# EAGLE design audio sense board rv1 (EAGLE 9.3.0)
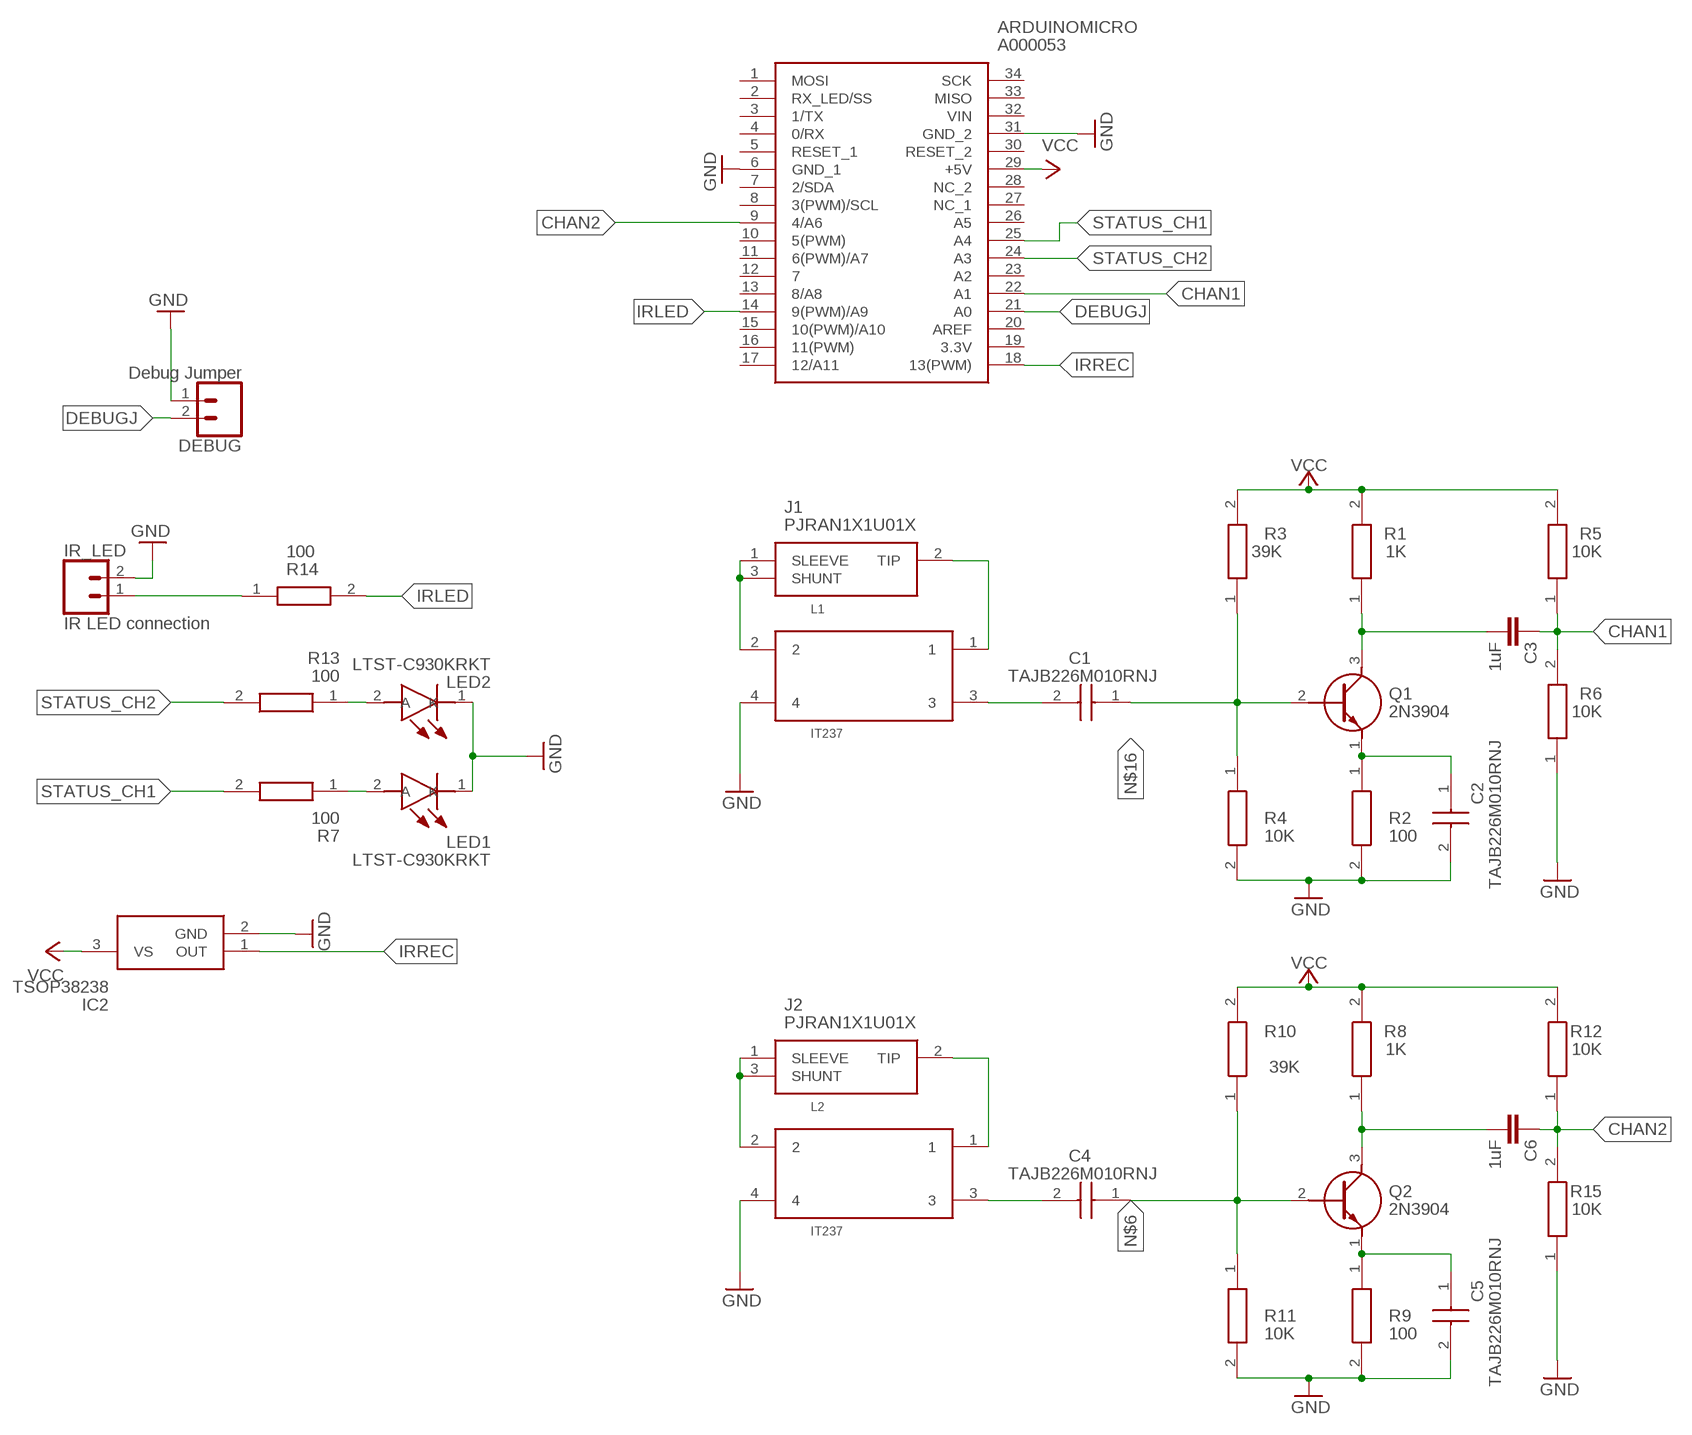
[diagram p0: schematic, sheet 1]

## Parts
ARDUINOMICRO  A000053  [HDRV34W70P1570X254_2X17_4900X1]
C1  TAJB226M010RNJ  [CAPPM3528X210N]
C2  TAJB226M010RNJ  [CAPPM3528X210N]
C3  1uF  22PF-PTH-2.54MM-200V-5%  [CAP-PTH-2.54]
C4  TAJB226M010RNJ  [CAPPM3528X210N]
C5  TAJB226M010RNJ  [CAPPM3528X210N]
C6  1uF  22PF-PTH-2.54MM-200V-5%  [CAP-PTH-2.54]
DEBUG  Debug Jumper  CONN_02LOCK  [1X02_LOCK]
IC2  TSOP38238  [TSOP38238]
IR_LED  IR LED connection  CONN_02LOCK  [1X02_LOCK]
J1  PJRAN1X1U01X  [PJRAN1X1U01X]
J2  PJRAN1X1U01X  [PJRAN1X1U01X]
L1  IT237  [IT237]
L2  IT237  [IT237]
LED1  LTST-C930KRKT  [LTSTC930KRKT]
LED2  LTST-C930KRKT  [LTSTC930KRKT]
Q1  2N3904  [CS_TO-92]
Q2  2N3904  [CS_TO-92]
R1  1K  ERJ-8GEYJ102V  [RESC3116X70N]
R2  100  ERJ8GEYJ101V  [RESC3116X70N]
R3  39K  ERJ8GEYJ101V  [RESC3116X70N]
R4  10K  ERJ8GEYJ101V  [RESC3116X70N]
R5  10K  ERJ8GEYJ101V  [RESC3116X70N]
R6  10K  ERJ8GEYJ101V  [RESC3116X70N]
R7  100  ERJ8GEYJ101V  [RESC3116X70N]
R8  1K  ERJ-8GEYJ102V  [RESC3116X70N]
R9  100  ERJ8GEYJ101V  [RESC3116X70N]
R10  39K  ERJ8GEYJ101V  [RESC3116X70N]
R11  10K  ERJ8GEYJ101V  [RESC3116X70N]
R12  10K  ERJ8GEYJ101V  [RESC3116X70N]
R13  100  ERJ8GEYJ101V  [RESC3116X70N]
R14  100  ERJ8GEYJ101V  [RESC3116X70N]
R15  10K  ERJ8GEYJ101V  [RESC3116X70N]

## Nets
CHAN1: ARDUINOMICRO.22(A1) C3.1 R5.1 R6.2
CHAN2: ARDUINOMICRO.9(4/A6) C6.1 R12.1 R15.2
DEBUGJ: ARDUINOMICRO.21(A0) DEBUG.2
GND: ARDUINOMICRO.6(GND_1) ARDUINOMICRO.31(GND_2) C2.2(-) C5.2(-) DEBUG.1 IC2.2(GND) IR_LED.2 L1.4 L2.4 LED1.1(K) LED2.1(K) R2.2 R4.2 R6.1 R9.2 R11.2 R15.1
IRLED: ARDUINOMICRO.14(9(PWM)/A9) R14.2
IRREC: ARDUINOMICRO.18(13(PWM)) IC2.1(OUT)
N$1: J2.1(SLEEVE) J2.3(SHUNT) L2.2
N$2: LED2.2(A) R13.1
N$3: J2.2(TIP) L2.1
N$4: LED1.2(A) R7.1
N$5: C4.2(-) L2.3
N$6: C4.1(+) Q2.2(B) R10.1 R11.1
N$7: C5.1(+) Q2.1(E) R9.1
N$8: C6.2 Q2.3(C) R8.1
N$9: IR_LED.1 R14.1
N$12: J1.1(SLEEVE) J1.3(SHUNT) L1.2
N$15: J1.2(TIP) L1.1
N$16: C1.1(+) Q1.2(B) R3.1 R4.1
N$17: C1.2(-) L1.3
N$20: C2.1(+) Q1.1(E) R2.1
N$21: C3.2 Q1.3(C) R1.1
STATUS_CH1: ARDUINOMICRO.25(A4) R7.2
STATUS_CH2: ARDUINOMICRO.24(A3) R13.2
VCC: ARDUINOMICRO.29(+5V) IC2.3(VS) R1.2 R3.2 R5.2 R8.2 R10.2 R12.2
Unconnected: ARDUINOMICRO.1(MOSI) ARDUINOMICRO.2(RX_LED/SS) ARDUINOMICRO.3(1/TX) ARDUINOMICRO.4(0/RX) ARDUINOMICRO.5(RESET_1) ARDUINOMICRO.7(2/SDA) ARDUINOMICRO.8(3(PWM)/SCL) ARDUINOMICRO.10(5(PWM)) ARDUINOMICRO.11(6(PWM)/A7) ARDUINOMICRO.12 ARDUINOMICRO.13(8/A8) ARDUINOMICRO.15(10(PWM)/A10) ARDUINOMICRO.16(11(PWM)) ARDUINOMICRO.17(12/A11) ARDUINOMICRO.19(3.3V) ARDUINOMICRO.20(AREF) ARDUINOMICRO.23(A2) ARDUINOMICRO.26(A5) ARDUINOMICRO.27(NC_1) ARDUINOMICRO.28(NC_2) ARDUINOMICRO.30(RESET_2) ARDUINOMICRO.32(VIN) ARDUINOMICRO.33(MISO) ARDUINOMICRO.34(SCK)

## Library data of the parts
ARDUINOMICRO = Samac Populated:A000053: Arduino Micro Arduino Micro Source: Datasheet <http://uk.rs-online.com/web/p/products/7717667>; DESCRIPTION: Arduino Micro Arduino Micro; HEIGHT: 16mm; MANUFACTURER_NAME: Arduino; MANUFACTURER_PART_NUMBER: A000053; MOUSER_PART_NUMBER: 782-A000053; MOUSER_PRICE-STOCK: https://www.mouser.com/Search/Refine.aspx?Keyword=782-A000053; RS_PART_NUMBER: 7717667; RS_PRICE-STOCK: http://uk.rs-online.com/web/p/products/7717667
C1 C2 C4 C5 = Samac Populated:TAJB226M010RNJ: Tantalum Capacitors - Solid SMD 10volts 22uF 20% Source: Datasheet <http://www.farnell.com/datasheets/1680476.pdf>; DESCRIPTION: Tantalum Capacitors - Solid SMD 10volts 22uF 20%; HEIGHT: 2.1mm; MANUFACTURER_NAME: AVX; MANUFACTURER_PART_NUMBER: TAJB226M010RNJ; MOUSER_PART_NUMBER: 581-TAJB226M010R; MOUSER_PRICE-STOCK: https://www.mouser.com/Search/Refine.aspx?Keyword=581-TAJB226M010R; RS_PART_NUMBER: 1354085; RS_PRICE-STOCK: http://uk.rs-online.com/web/p/products/1354085
C3 C6 = SparkFun-Capacitors:22PF: 22pF ceramic capacitors A capacitor is a passive two-terminal electrical component used to store electrical energy temporarily in an electric field.; PROD_ID: CAP-09128; VALUE: 22pF
DEBUG IR_LED = SparkFun-Connectors:CONN_02: Multi connection point. Often used as Generic Header-pin footprint for 0.1 inch spaced/style header connections On any of the 0.1 inch spaced packages, you can populate with these: Break Away Headers - Straight <https://www.sparkfun.com/products/116> (PRT-00116) Break Away Male Headers - Right Angle <https://www.sparkfun.com/products/553> (PRT-00553) Female Headers <https://www.sparkfun.com/products/115> (PRT-00115) Break Away Headers - Machine Pin <https://www.sparkfun.com/products/117> (PRT-00117) Break Away Female Headers - Swiss Machine Pin <https://www.sparkfun.com/products/743> (PRT-00743) For SCREWTERMINALS and SPRING TERMINALS visit here: Screw Terimnals on SparkFun.com <https://www.sparkfun.com/search/results?term=Screw+Terminals> (5mm/3.5mm/2.54mm spacing) This device is also useful as a general connection point to wire up your design to another part of your project. Our various solder wires solder well into these plated through hole pads. Hook-Up Wire - Assortment (Stranded, 22 AWG) <https://www.sparkfun.com/products/11375> (PRT-11375) Hook-Up Wire - Assortment (Solid Core, 22 AWG) <https://www.sparkfun.com/products/11367> (PRT-11367) View the entire wire category on our website here <https://www.sparkfun.com/categories/141> Special notes: Molex polarized connector foot print use with: PRT-08233 with associated crimp pins and housings. 2.54_SCREWTERM for use with PRT-10571. 3.5mm Screw Terminal footprints for PRT-08084 5mm Screw Terminal footprints for use with PRT-08432
IC2 = Samac Populated:TSOP38238: IR Remote Receiver 38KHz 45m Source: Datasheet <http://uk.rs-online.com/web/p/products/7085086>; ALLIED_NUMBER: 70331872; ALLIED_PRICE-STOCK: https://www.alliedelec.com/vishay-dale-tsop38238/70331872/; DESCRIPTION: IR Remote Receiver 38KHz 45m; HEIGHT: mm; MANUFACTURER_NAME: Vishay; MANUFACTURER_PART_NUMBER: TSOP38238; MOUSER_PART_NUMBER: 782-TSOP38238; MOUSER_PRICE-STOCK: https://www.mouser.com/Search/Refine.aspx?Keyword=782-TSOP38238; RS_PART_NUMBER: 8651883; RS_PRICE-STOCK: http://uk.rs-online.com/web/p/products/8651883
J1 J2 = Samac Populated:PJRAN1X1U01X: SWITCHCRAFT/CONXALL - PJRAN1X1U01X - CONNECTOR, RCA/PHONO, JACK, 1 POSITION Source: Datasheet <https://componentsearchengine.com/Datasheets/1/PJRAN1X1U01X.pdf>; ALLIED_NUMBER: 70931429; ALLIED_PRICE-STOCK: https://www.alliedelec.com/switchcraft-pjran1x1u01x/70931429/; DESCRIPTION: SWITCHCRAFT/CONXALL - PJRAN1X1U01X - CONNECTOR, RCA/PHONO, JACK, 1 POSITION; HEIGHT: 13mm; MANUFACTURER_NAME: Switchcraft; MANUFACTURER_PART_NUMBER: PJRAN1X1U01X; MOUSER_PART_NUMBER: 502-PJRAN1X1U01X; MOUSER_PRICE-STOCK: https://www.mouser.com/Search/Refine.aspx?Keyword=502-PJRAN1X1U01X
L1 L2 = My Library:IT237: Shaffener IT237 Data Sheet <https://www.schaffner.com/products/download/product/datasheet/it-series-pulse-transformer-with-single-secondary-winding/> turns 1:1 Ignition Current: 0.25A Unom: 500V Up 2.5kV Voltage time Area: 1100Vus Rise time: 1us Inductance Lp: 25mH Inductance Lstr: 35uH Resistance Rp: 1.9ohms Resistnace Rs: 2.2ohms Coupling capacitance Ck: 50pF Weight: 14g
LED1 LED2 = Samac Populated:LTST-C930KRKT: LED, Red LTST-C930KRKT, Lite-On 631 nm 3125 (1210) SMD package Source: Datasheet <http://optoelectronics.liteon.com/upload/download/DS22-2000-094/LTST-C930KRKT.pdf>; DESCRIPTION: LED, Red LTST-C930KRKT, Lite-On 631 nm 3125 (1210) SMD package; HEIGHT: 2.5mm; MANUFACTURER_NAME: Lite-On; MANUFACTURER_PART_NUMBER: LTST-C930KRKT; MOUSER_PART_NUMBER: 859-LTST-C930KRKT; MOUSER_PRICE-STOCK: https://www.mouser.com/Search/Refine.aspx?Keyword=859-LTST-C930KRKT; RS_PART_NUMBER: 1689768; RS_PRICE-STOCK: http://uk.rs-online.com/web/p/products/1689768
Q1 Q2 = Samac Populated:2N3904: Bipolar Transistors - BJT NPN Gen Pur SS Source: Datasheet <https://my.centralsemi.com/get_document.php?cmp=1&mergetype=pd&mergepath=pd&pdf_id=2N3903.PDF>; DESCRIPTION: Bipolar Transistors - BJT NPN Gen Pur SS; HEIGHT: mm; MANUFACTURER_NAME: Central Semiconductor; MANUFACTURER_PART_NUMBER: 2N3904; MOUSER_PART_NUMBER: 610-2N3904; MOUSER_PRICE-STOCK: https://www.mouser.com/Search/Refine.aspx?Keyword=610-2N3904
R1 R8 = Samac Populated:ERJ-8GEYJ102V: Thick Film Resistors - SMD 1206 1Kohms 5% Tol AEC-Q200 Source: Datasheet <http://industrial.panasonic.com/www-cgi/jvcr13pz.cgi?E PZ 3 AOA0001 ERJ8GEYJ102V 7 WW>; ALLIED_NUMBER: 70266199; ALLIED_PRICE-STOCK: https://www.alliedelec.com/panasonic-erj-8geyj102v/70266199/; DESCRIPTION: Thick Film Resistors - SMD 1206 1Kohms 5% Tol AEC-Q200; HEIGHT: 0.7mm; MANUFACTURER_NAME: Panasonic; MANUFACTURER_PART_NUMBER: ERJ-8GEYJ102V; MOUSER_PART_NUMBER: 667-ERJ-8GEYJ102V; MOUSER_PRICE-STOCK: https://www.mouser.com/Search/Refine.aspx?Keyword=667-ERJ-8GEYJ102V
R2-R7 R9-R15 = Samac Populated:ERJ8GEYJ101V: PANASONIC ELECTRONIC COMPONENTS - ERJ8GEYJ101V - RES, THICK FILM, 100R, 5%, 0.25W, 1206 Source: Datasheet <https://componentsearchengine.com/Datasheets/2/ERJ8GEYJ101V.pdf>; ALLIED_NUMBER: 70265175; ALLIED_PRICE-STOCK: https://www.alliedelec.com/panasonic-erj-8geyj101v/70265175/; DESCRIPTION: PANASONIC ELECTRONIC COMPONENTS - ERJ8GEYJ101V - RES, THICK FILM, 100R, 5%, 0.25W, 1206; HEIGHT: 0.7mm; MANUFACTURER_NAME: Panasonic; MANUFACTURER_PART_NUMBER: ERJ8GEYJ101V

## Net classes
0 default: width 0.305 mm, drill 0.508 mm, clearance 0.254 mm

## Board
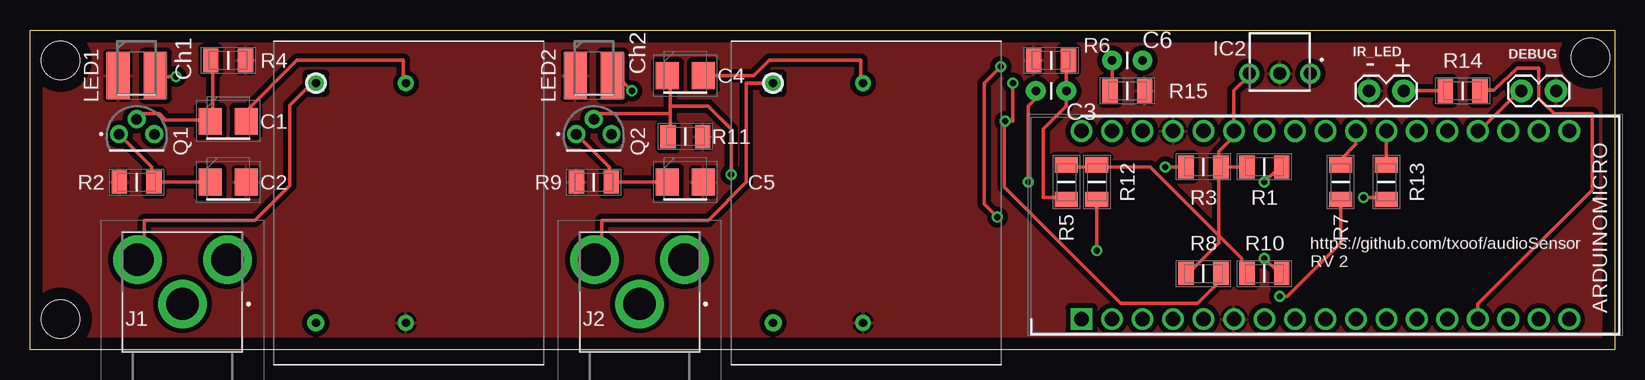
[diagram p1: board, top side]
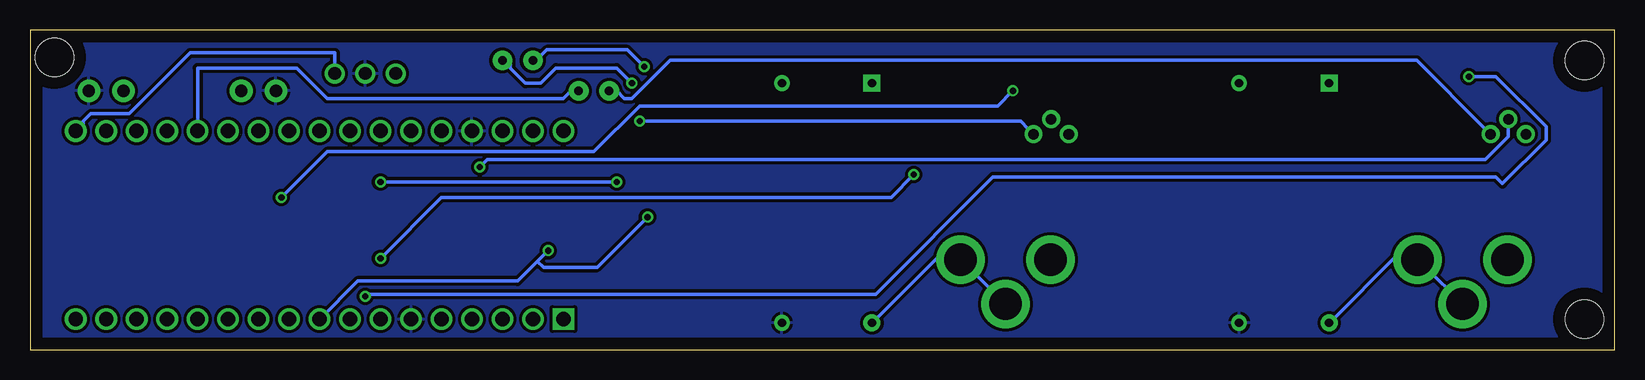
[diagram p2: board, bottom side, seen from below]

Size 132.08 x 26.67 mm. Coordinates in mm from the lower left corner, seen from the top.
Outline: 0,0 0,26.67 132.08,26.67 132.08,0 0,0
Copper layers (1*16): Top 0.035mm / dielectric 1.5mm / Bottom 0.035mm
Design rules "default *": minimum track width 6mil, minimum drill 0.35mm, track to track 10mil, track to pad 6mil, pad to pad 6mil, via to via 6mil, smd to smd 6mil, copper to edge 40mil, drill to drill 6mil, minimum pad ring 12mil, minimum via ring 8mil, stop-mask expansion 4mil, vias tented up to drill 0mil, thermal gap 10mil
Holes 3.2 mm at 130.05,24.38 2.54,24.13 2.54,2.54

### Footprints (pad centres in the part's own frame; a part is rotated, then mirrored left to right if it is on the bottom)
HDRV34W70P1570X254_2X17_4900X1 = drill 1.2 pad 1.8 square: 1 0,0 | drill 1.2 pad 1.8: 2 2.54,0; 3 5.08,0; 4 7.62,0; 5 10.16,0; 6 12.7,0; 7 15.24,0; 8 17.78,0; 9 20.32,0; 10 22.86,0; 11 25.4,0; 12 27.94,0; 13 30.48,0; 14 33.02,0; 15 35.56,0; 16 38.1,0; 17 40.64,0; 18 40.64,15.7; 19 38.1,15.7; 20 35.56,15.7; 21 33.02,15.7; 22 30.48,15.7; 23 27.94,15.7; 24 25.4,15.7; 25 22.86,15.7; 26 20.32,15.7; 27 17.78,15.7; 28 15.24,15.7; 29 12.7,15.7; 30 10.16,15.7; 31 7.62,15.7; 32 5.08,15.7; 33 2.54,15.7; 34 0,15.7
CAPPM3528X210N = smd 1.905 x 2.235: 1 -1.5,0; 2 1.5,0
CAP-PTH-2.54 = drill 0.7 pad 1.651: 1 -1.27,0; 2 1.27,0
1X02_LOCK = drill 1.016 pad 1.88: 1 -0.178,0; 2 2.718,0
TSOP38238 = drill 1.06 pad 1.56: 1 -2.54,-1.45; 2 0,-1.45; 3 2.54,-1.45
PJRAN1X1U01X = drill 2.693 pad 4.039: 1 0,0; 2 -3.75,3.7; 3 3.75,3.7
IT237 = drill 0.7 pad 1.422 square: 1 23.5,-3.5 | drill 0.7 pad 1.422: 2 3.5,-3.5 | drill 0.7 pad 1.27: 3 23.5,-11; 4 3.5,-11
LTSTC930KRKT = smd 1.93 x 3.81: 1 -1.55,0; 2 1.55,0
CS_TO-92 = drill 0.88 pad 1.35: 1 -1.47,-2.35 | drill 0.88 pad 1.4: 2 0,-1.092; 3 1.47,-2.35
RESC3116X70N = smd 1.27 x 1.93: 1 -1.45,0; 2 1.45,0

### Placement (x,y rotation side)
ARDUINOMICRO  87.63,2.54 0 top
C1  16.51,19.05 0 top
C2  16.51,13.97 0 top
C3  85.09,21.59 180 top
C4  54.61,22.86 0 top
C5  54.61,13.97 0 top
C6  91.44,24.13 0 top
DEBUG  127,21.59 180 top
IC2  104.14,21.59 180 top
IR_LED  114.3,21.59 180 top
J1  12.7,3.81 0 top
J2  50.8,3.81 0 top
L1  20.32,-1.27 90 top
L2  58.42,-1.27 90 top
LED1  8.89,22.86 0 top
LED2  46.99,22.86 0 top
Q1  8.89,20.32 0 top
Q2  46.99,20.32 0 top
R1  102.87,15.24 180 top
R2  8.89,13.97 180 top
R3  97.79,15.24 0 top
R4  16.51,24.13 0 top
R5  86.36,13.97 90 top
R6  85.09,24.13 0 top
R7  109.22,13.97 90 top
R8  97.79,6.35 180 top
R9  46.99,13.97 180 top
R10  102.87,6.35 180 top
R11  54.61,17.78 0 top
R12  88.9,13.97 90 top
R13  113.03,13.97 90 top
R14  119.38,21.59 0 top
R15  91.44,21.59 180 top

### Tracks (layer width: path | path; a pad name or v marks a point on that pad's centre or on a via)
CHAN1
  Top 0.305: R5.1 86.36,12.7 84.45,12.7 84.45,18.41 86.36,20.32 C3.1 86.36,24.13 R6.2
  Bottom 0.305: ARDUINOMICRO.22 118.11,23.5 109.86,23.5 107.31,20.95 87.63,20.95 87,21.59 C3.1
CHAN2  (via drill 0.51)
  Top 0.305: 90.17,22.23 90.17,21.59 R15.2 90.17,22.23 | 90.17,22.23 C6.1 | R12.1 v88.9,8.26 | v80.9,23.62 79.5,22.23 79.5,12.17 v80.62,11.05
  Bottom 0.305: ARDUINOMICRO.9 104.78,5.71 91.44,5.71 89.79,7.37 | v88.9,8.26 89.79,7.37 | v80.9,23.62 82.3,25.02 89,25.02 89.84,24.18 90.12,24.18 C6.1 | v80.62,11.05 84.81,6.86 89.28,6.86 89.79,7.37
DEBUGJ
  Top 0.305: ARDUINOMICRO.21 120.85,18.31 124.21,21.67 DEBUG.2
GND
  pour Top (isolate 0.406): -1.27,83.82 143.51,83.82 143.51,-1.27 -1.27,-1.27
  pour Bottom: -3.81,71.12 -3.81,-6.35 149.86,-6.35 149.86,71.12
IRLED
  Top 0.305: ARDUINOMICRO.14 120.65,3.81 130.18,13.34 130.18,19.68 127,19.68 125.73,20.95 125.73,23.5 123.93,23.5 121.97,21.67 121.13,21.67 R14.2
IRREC
  Bottom 0.305: IC2.1 106.68,24.77 118.75,24.77 123.83,19.68 127,19.68 127.64,19.05 127.64,18.41 128.27,18.41 ARDUINOMICRO.18
N$1
  Bottom 0.305: L2.2 61.59,2.54 56.52,7.62 54.61,7.62 J2.3 53.98,6.99 J2.1
N$2  (via drill 0.51)
  Top 0.305: v111.12,12.7 113.03,12.7 R13.1 | v50.16,21.59 48.9,22.86 LED2.2
  Bottom 0.305: v111.12,12.7 107.31,16.51 85.09,16.51 81.28,20.32 51.44,20.32 v50.16,21.59
N$3
  Top 0.305: L2.1 61.59,22.23 59.69,22.23 59.69,13.97 56.52,10.79 47.62,10.79 47.62,7.62 J2.2
N$4  (via drill 0.51)
  Top 0.305: v104.14,4.45 104.78,4.45 109.22,8.89 R7.1 | v12.17,22.78 10.49,22.78 LED1.2
  Bottom 0.305: v12.17,22.78 9.93,22.78 5.74,18.59 5.74,17.48 9.37,13.84 9.93,14.4 51.84,14.4 61.62,4.62 104.09,4.62 v104.14,4.45
N$5
  Top 0.305: C4.2 60.33,22.86 61.59,24.13 69.22,24.13 69.22,22.86 L2.3
N$6  (via drill 0.51)
  Top 0.305: 53.34,20.32 53.34,22.86 C4.1 | 53.34,20.32 53.34,19.68 | 53.34,19.68 53.34,17.78 R11.1 | v102.87,7.62 104.14,6.35 R10.1 | v58.42,14.61 58.42,18.41 56.52,20.32 53.34,20.32 | 53.34,19.68 46.99,19.68 Q2.2
  Bottom 0.305: v102.87,7.62 97.79,12.7 60.33,12.7 v58.42,14.61
N$7
  Top 0.305: C5.1 R9.1 48.26,13.97 48.26,15.24 45.72,17.78 Q2.1
N$8  (via drill 0.51)
  Top 0.305: v81.92,22.23 81.92,19.05 v81.28,19.05 81.18,18.87 81.18,13.56 90.88,3.86 97.33,3.86 99.24,5.77 R8.1
  Bottom 0.305: v81.92,22.23 83.19,23.5 88.27,23.5 89.53,22.23 90.81,22.23 92.08,23.5 92.08,24.13 C6.2 | v81.28,19.05 49.53,19.05 48.9,18.41 Q2.3
N$9
  Top 0.305: IR_LED.1 R14.1
N$12
  Bottom 0.305: L1.2 23.5,2.54 18.41,7.62 16.51,7.62 J1.3 15.88,6.99 J1.1
N$15
  Top 0.305: L1.1 23.5,22.23 21.67,20.4 21.67,13.69 18.75,10.77 9.53,10.77 9.53,7.62 J1.2
N$16  (via drill 0.51)
  Top 0.305: v94.61,15.24 R3.1 | Q1.2 8.89,19.68 10.79,19.68 11.33,19.15 14.96,19.15 C1.1 15.24,19.15 15.24,23.9 R4.1
  Bottom 0.305: v94.61,15.24 93.98,15.88 10.79,15.88 8.89,17.78 Q1.2
N$17
  Top 0.305: C1.2 18.01,19.91 22.23,24.13 31.11,24.13 31.11,22.86 L1.3
N$20
  Top 0.305: C2.1 R2.1 10.16,13.97 10.16,15.24 7.62,17.78 Q1.1
N$21  (via drill 0.51)
  Top 0.305: v102.87,13.97 104.14,15.24 R1.1 | v83.19,13.97 83.19,20.32 83.82,20.95 C3.2
  Bottom 0.305: v83.19,13.97 v102.87,13.97 | C3.2 83.19,21.59 82.55,20.95 81.92,20.95 78.74,24.13 16.51,24.13 10.79,18.41 Q1.3
STATUS_CH1
  Top 0.305: ARDUINOMICRO.25 110.49,17.14 109.22,15.88 R7.2
STATUS_CH2
  Top 0.305: ARDUINOMICRO.24 R13.2
VCC
  Top 0.305: IC2.3 101.6,22.86 100.33,21.59 ARDUINOMICRO.29 100.33,17.78 99.06,16.51 99.06,15.24 | 88.9,15.24 86.36,15.24 R5.2 | 99.06,15.24 99.06,9.53 | 99.06,9.53 99.06,8.89 96.52,6.35 R8.2 | 99.06,9.53 100.97,7.62 100.97,6.35 R10.2 | R1.2 R3.2 99.06,15.24 | 88.9,15.24 93.34,15.24 99.06,9.53 | 88.9,15.24 R12.2

### Text on the board
tPlace: Ch1 | Ch2 | - | +
tNames: https://github.com/txoof/audioSensor / RV 2